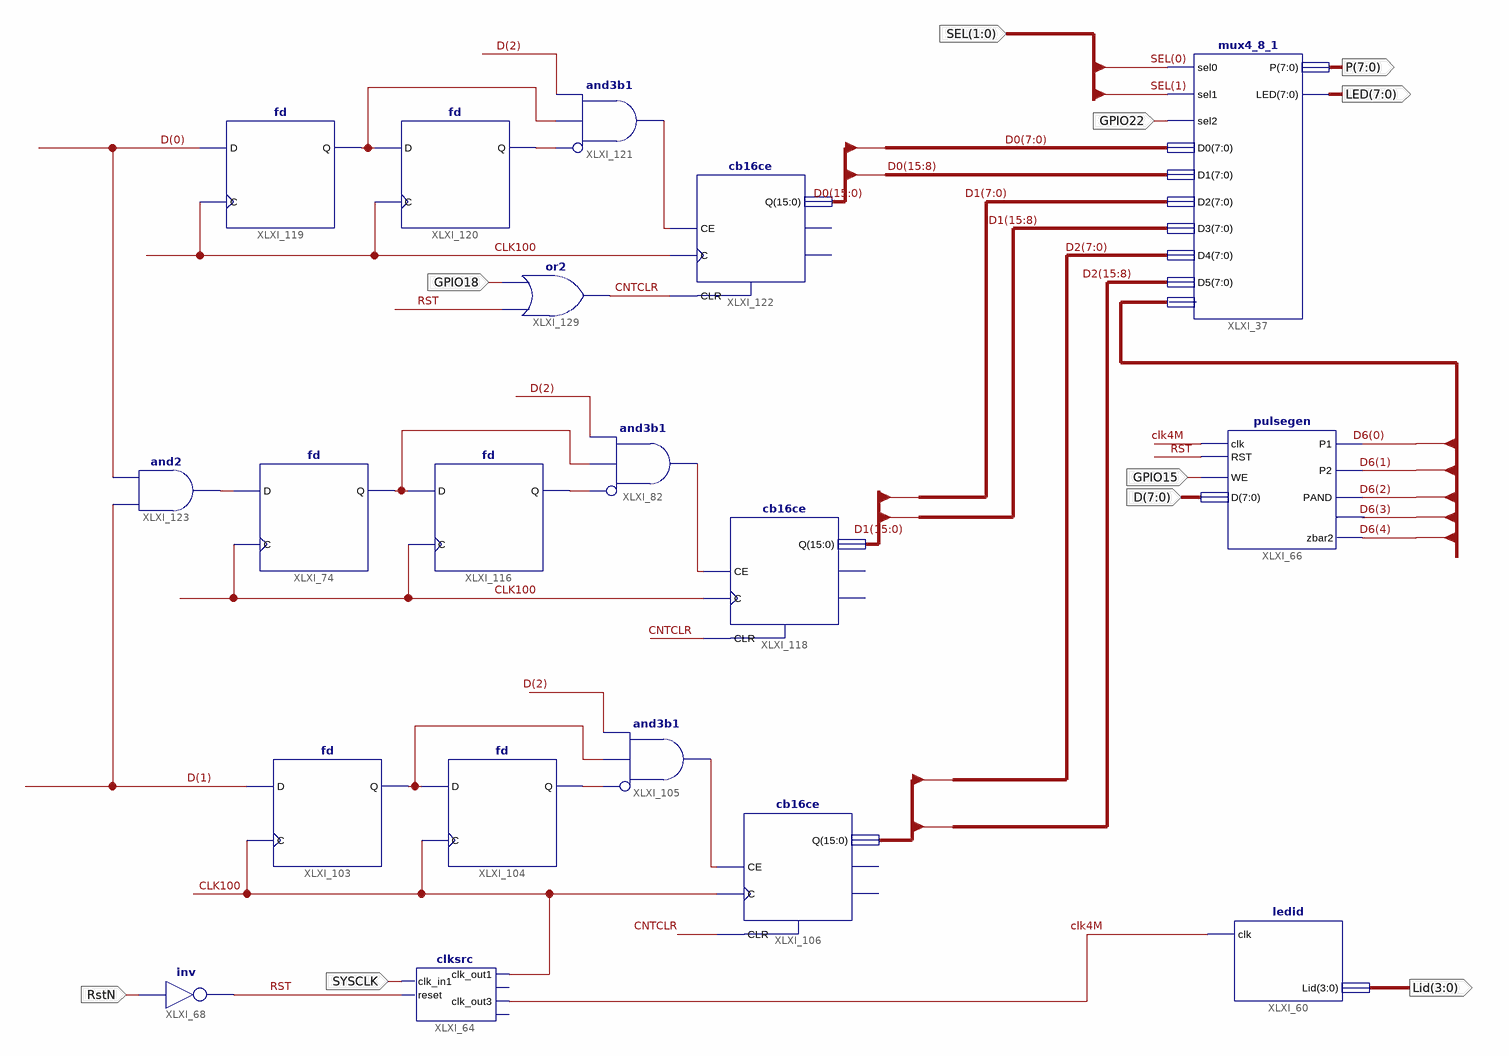
[diagram p0: schematic sheet 1]
// Xilinx ISE schematic digpr2top.sch (spartan6) as structural Verilog: 19 symbols, 10 ports
module digpr2top (
  input  GPIO22,
  input  RstN,
  input  [7:0] D,
  input  GPIO15,
  input  SYSCLK,
  input  GPIO18,
  input  [1:0] SEL,
  output [7:0] P,
  output [7:0] LED,
  output [3:0] Lid
);

  wire clk4M, CLK100, CNTCLR, RST, XLXN_297, XLXN_298, XLXN_302, XLXN_343, XLXN_344, XLXN_348, XLXN_350,
       XLXN_351, XLXN_357, XLXN_358;
  wire [7:0] D6;
  wire [15:0] D0, D1, D2;

  mux4_8_1 XLXI_37 (
    .sel0(SEL[0]), .sel1(SEL[1]), .sel2(GPIO22), .D0(D0[7:0]), .D1(D0[15:8]), .D2(D1[7:0]), .D3(D1[15:8]),
    .D4(D2[7:0]), .D5(D2[15:8]), .P(P), .LED(LED), .D6(D6));
  ledid XLXI_60 (.clk(clk4M), .Lid(Lid));
  not XLXI_68 (RST, RstN);
  fd XLXI_103 (.C(CLK100), .D(D[1]), .Q(XLXN_297));
  fd XLXI_104 (.C(CLK100), .D(XLXN_297), .Q(XLXN_298));
  and XLXI_105 (XLXN_302, ~XLXN_298, XLXN_297, D[2]);  // and3b1
  cb16ce XLXI_106 (.C(CLK100), .CE(XLXN_302), .CLR(CNTCLR), .Q(D2));  // open: CEO, TC
  fd XLXI_74 (.C(CLK100), .D(XLXN_358), .Q(XLXN_343));
  fd XLXI_116 (.C(CLK100), .D(XLXN_343), .Q(XLXN_344));
  and XLXI_82 (XLXN_348, ~XLXN_344, XLXN_343, D[2]);  // and3b1
  cb16ce XLXI_118 (.C(CLK100), .CE(XLXN_348), .CLR(CNTCLR), .Q(D1));  // open: CEO, TC
  fd XLXI_119 (.C(CLK100), .D(D[0]), .Q(XLXN_350));
  fd XLXI_120 (.C(CLK100), .D(XLXN_350), .Q(XLXN_351));
  and XLXI_121 (XLXN_357, ~XLXN_351, XLXN_350, D[2]);  // and3b1
  cb16ce XLXI_122 (.C(CLK100), .CE(XLXN_357), .CLR(CNTCLR), .Q(D0));  // open: CEO, TC
  and XLXI_123 (XLXN_358, D[1], D[0]);
  pulsegen XLXI_66 (
    .clk(clk4M), .D(D), .P1(D6[0]), .P2(D6[1]), .PAND(D6[2]), .RST(RST), .WE(GPIO15), .zbar1(D6[3]),
    .zbar2(D6[4]));
  clksrc XLXI_64 (.clk_in1(SYSCLK), .reset(RST), .clk_out1(CLK100), .clk_out3(clk4M));  // open: clk_out2, locked
  or XLXI_129 (CNTCLR, RST, GPIO18);
endmodule
